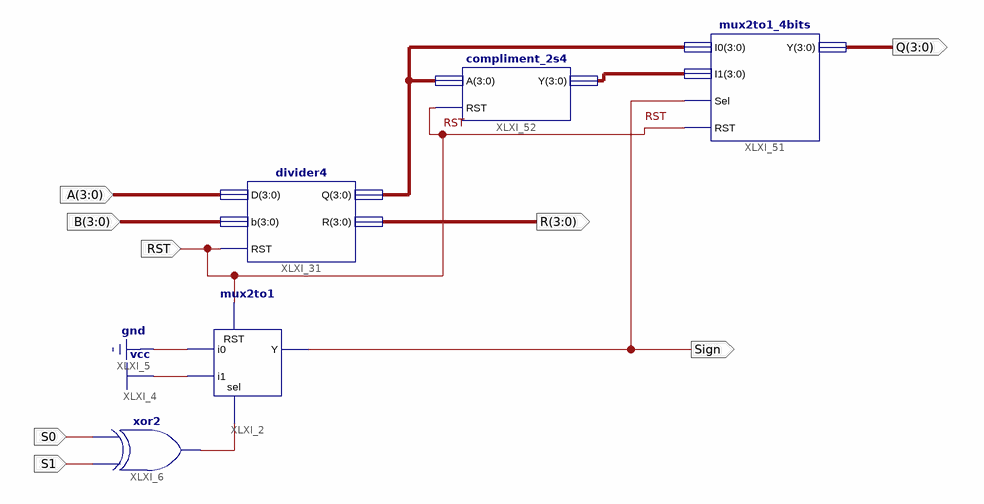
[diagram p0: schematic sheet 1]
// Xilinx ISE schematic division_block.sch (artix7) as structural Verilog: 5 symbols, 8 ports
module division_block (
  input  [3:0] B,
  input  [3:0] A,
  input  RST,
  input  S1,
  input  S0,
  output [3:0] Q,
  output [3:0] R,
  output Sign
);

  wire XLXN_48;
  wire [3:0] XLXN_106, XLXN_107;

  mux2to1_4bits XLXI_51 (.I0(XLXN_106), .I1(XLXN_107), .RST(RST), .Sel(Sign), .Y(Q));
  compliment_2s4 XLXI_52 (.A(XLXN_106), .RST(RST), .Y(XLXN_107));
  divider4 XLXI_31 (.b(B), .D(A), .Q(XLXN_106), .R(R), .RST(RST));
  xor XLXI_6 (XLXN_48, S1, S0);
  mux2to1 XLXI_2 (.i0(1'b0), .i1(1'b1), .RST(RST), .sel(XLXN_48), .Y(Sign));
endmodule
